# EAGLE schematic dual_motor_driver_v6 (EAGLE 8.2.2)
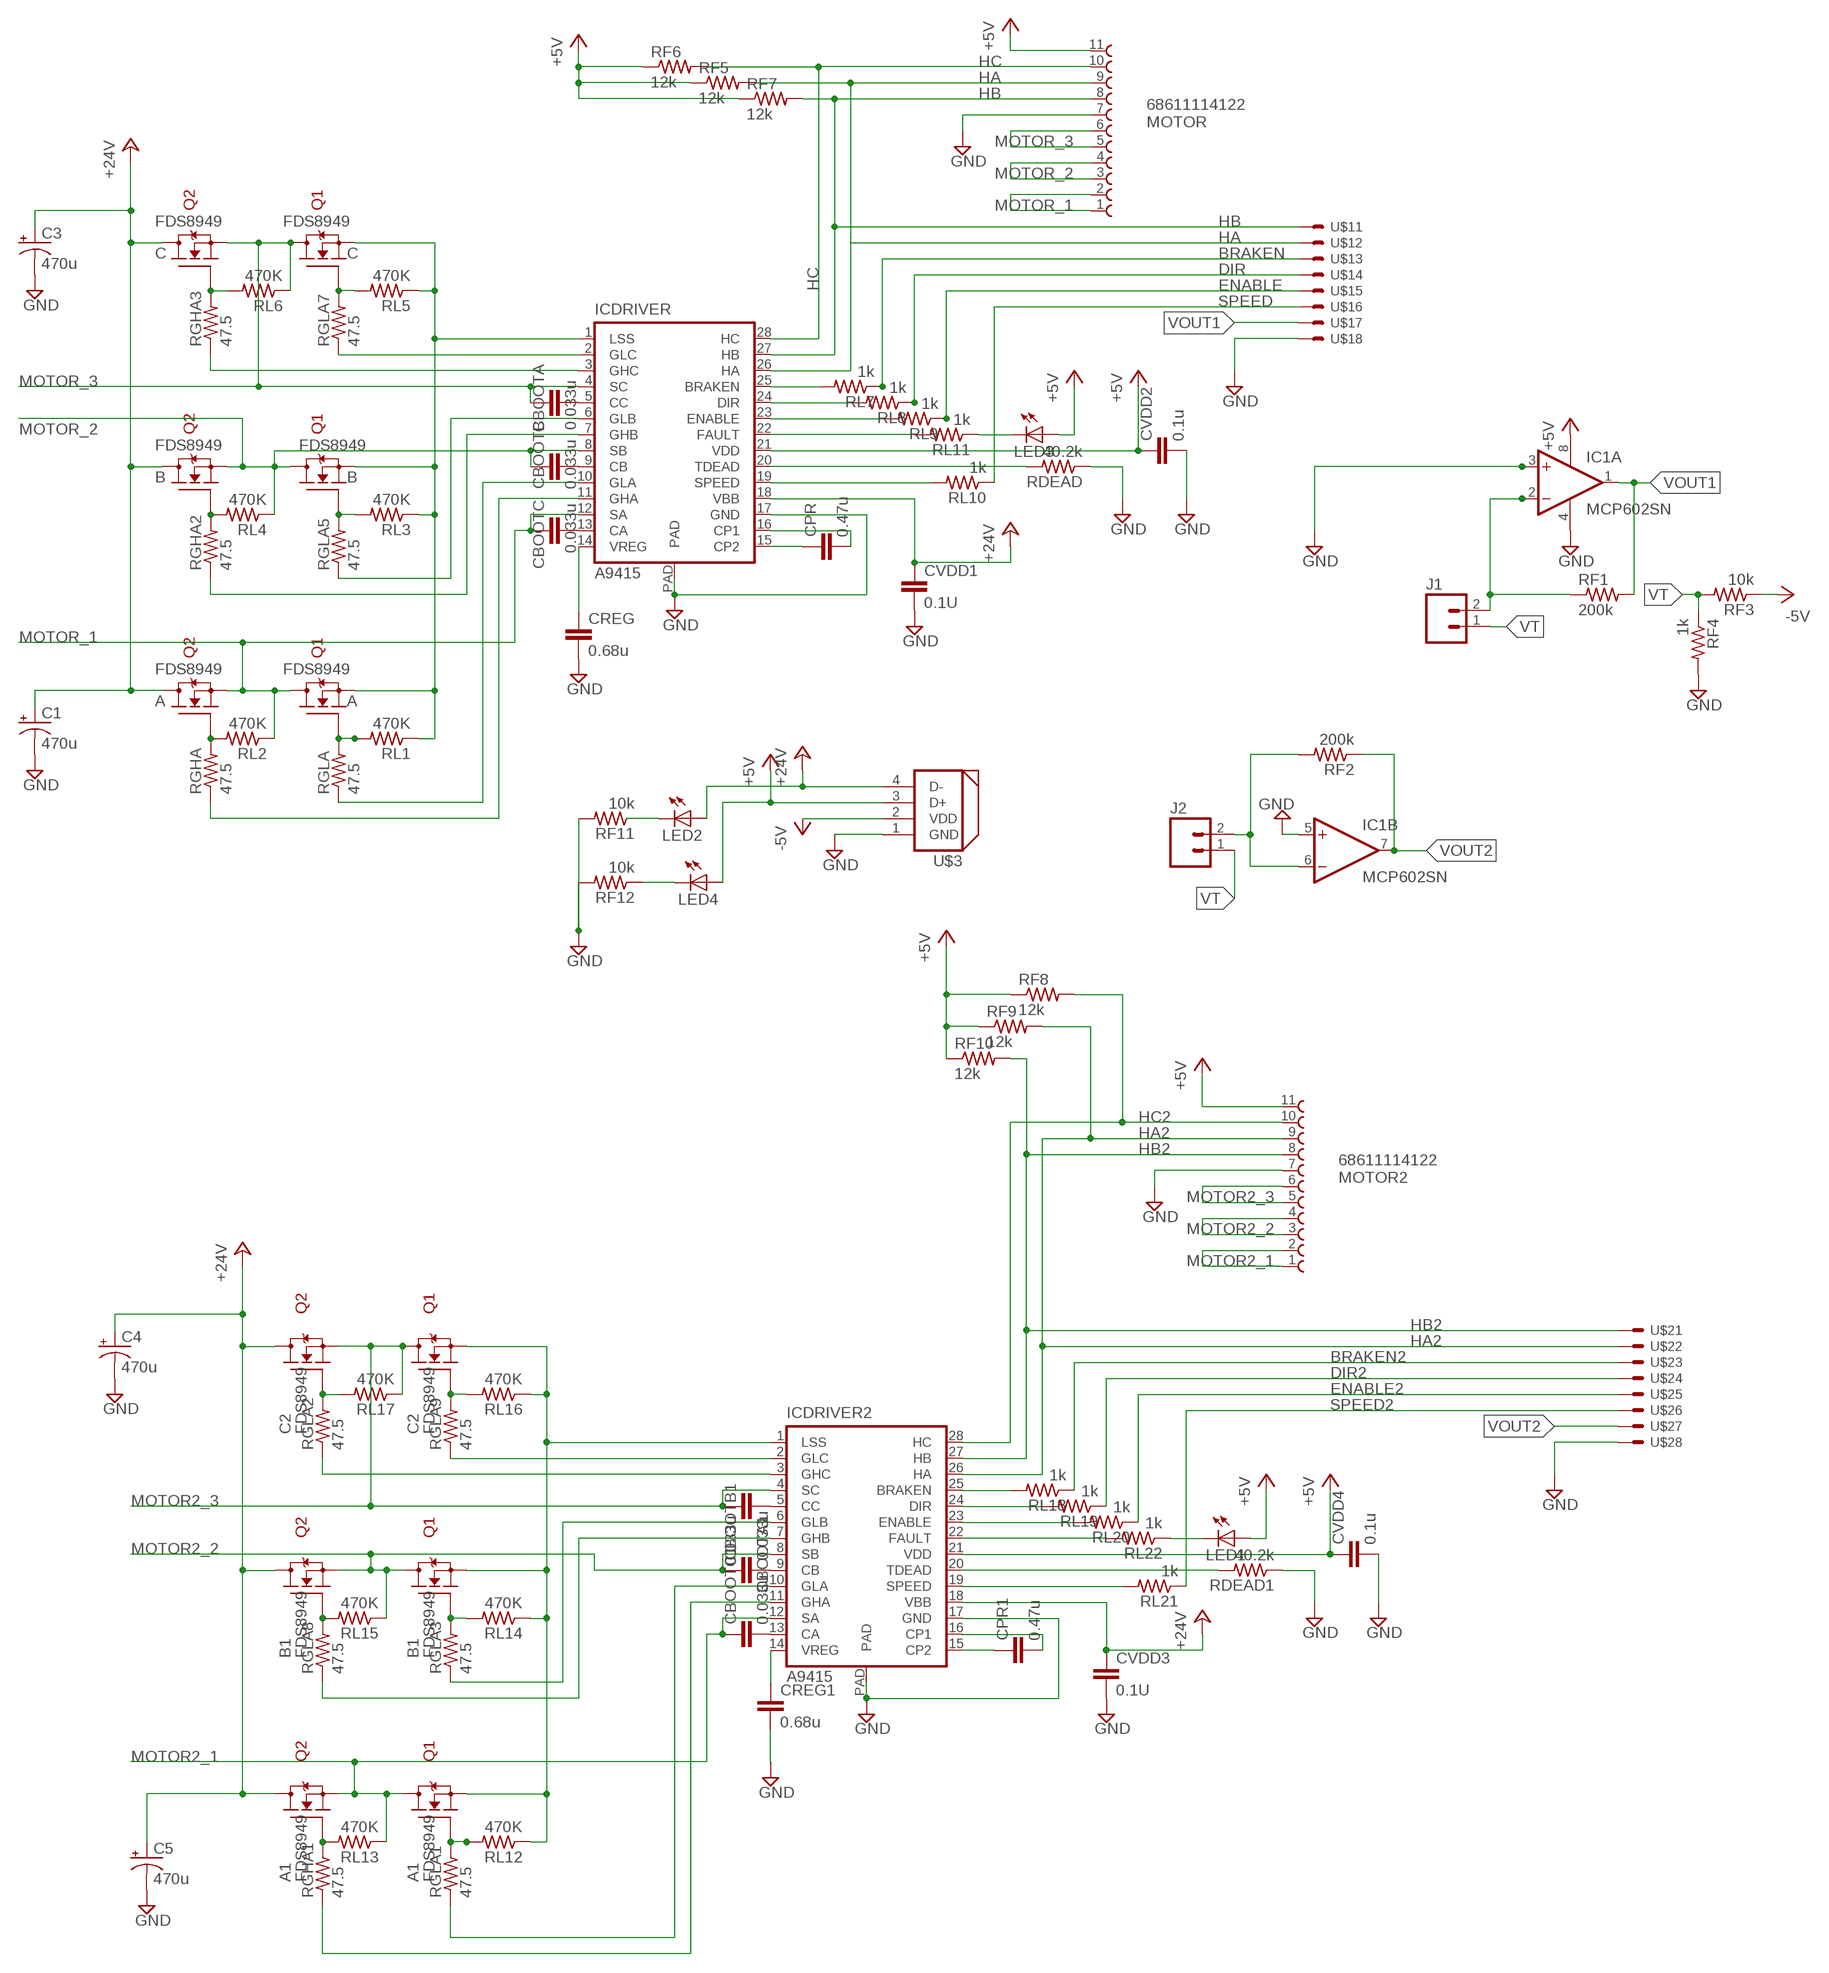
[diagram p0: schematic, sheet 1]

## Parts
A  FDS8949  [SOIC8]
A1  FDS8949  [SOIC8]
B  FDS8949  [SOIC8]
B1  FDS8949  [SOIC8]
C  FDS8949  [SOIC8]
C1  470u  CPOL-US140CLH-1010  [140CLH-1010]
C2  FDS8949  [SOIC8]
C3  470u  CPOL-US140CLH-1010  [140CLH-1010]
C4  470u  CPOL-US140CLH-1010  [140CLH-1010]
C5  470u  CPOL-US140CLH-1010  [140CLH-1010]
CBOOTA  0.033u  C-EUC0805  [C0805]
CBOOTA1  0.033u  C-EUC0805  [C0805]
CBOOTB  0.033u  C-EUC0805  [C0805]
CBOOTB1  0.033u  C-EUC0805  [C0805]
CBOOTC  0.033u  C-EUC0805  [C0805]
CBOOTC1  0.033u  C-EUC0805  [C0805]
CPR  0.47u  C-EUC0805  [C0805]
CPR1  0.47u  C-EUC0805  [C0805]
CREG  0.68u  C-EUC0805  [C0805]
CREG1  0.68u  C-EUC0805  [C0805]
CVDD1  0.1U  C-EUC0805  [C0805]
CVDD2  0.1u  C-EUC0805  [C0805]
CVDD3  0.1U  C-EUC0805  [C0805]
CVDD4  0.1u  C-EUC0805  [C0805]
IC1  MCP602SN  [SO08]
ICDRIVER  A9415  [TSSOP28]
ICDRIVER2  A9415  [TSSOP28]
J1  M02PTH  [1X02]
J2  M02PTH  [1X02]
LED1  LEDCHIPLED_0805  [CHIPLED_0805]
LED2  LEDCHIPLED_0805  [CHIPLED_0805]
LED3  LEDCHIPLED_0805  [CHIPLED_0805]
LED4  LEDCHIPLED_0805  [CHIPLED_0805]
MOTOR  68611114122  [68611114122]
MOTOR2  68611114122  [68611114122]
RDEAD  40.2k  R-US_R0805  [R0805]
RDEAD1  40.2k  R-US_R0805  [R0805]
RF1  200k  R-US_R0805  [R0805]
RF2  200k  R-US_R0805  [R0805]
RF3  10k  R-US_R0805  [R0805]
RF4  1k  R-US_R0805  [R0805]
RF5  12k  R-US_R0805  [R0805]
RF6  12k  R-US_R0805  [R0805]
RF7  12k  R-US_R0805  [R0805]
RF8  12k  R-US_R0805  [R0805]
RF9  12k  R-US_R0805  [R0805]
RF10  12k  R-US_R0805  [R0805]
RF11  10k  R-US_R0805  [R0805]
RF12  10k  R-US_R0805  [R0805]
RGHA  47.5  R-US_R0805  [R0805]
RGHA1  47.5  R-US_R0805  [R0805]
RGHA2  47.5  R-US_R0805  [R0805]
RGHA3  47.5  R-US_R0805  [R0805]
RGLA  47.5  R-US_R0805  [R0805]
RGLA1  47.5  R-US_R0805  [R0805]
RGLA2  47.5  R-US_R0805  [R0805]
RGLA3  47.5  R-US_R0805  [R0805]
RGLA5  47.5  R-US_R0805  [R0805]
RGLA7  47.5  R-US_R0805  [R0805]
RGLA8  47.5  R-US_R0805  [R0805]
RGLA9  47.5  R-US_R0805  [R0805]
RL1  470K  R-US_R0805  [R0805]
RL2  470K  R-US_R0805  [R0805]
RL3  470K  R-US_R0805  [R0805]
RL4  470K  R-US_R0805  [R0805]
RL5  470K  R-US_R0805  [R0805]
RL6  470K  R-US_R0805  [R0805]
RL7  1k  R-US_R0805  [R0805]
RL8  1k  R-US_R0805  [R0805]
RL9  1k  R-US_R0805  [R0805]
RL10  1k  R-US_R0805  [R0805]
RL11  1k  R-US_R0805  [R0805]
RL12  470K  R-US_R0805  [R0805]
RL13  470K  R-US_R0805  [R0805]
RL14  470K  R-US_R0805  [R0805]
RL15  470K  R-US_R0805  [R0805]
RL16  470K  R-US_R0805  [R0805]
RL17  470K  R-US_R0805  [R0805]
RL18  1k  R-US_R0805  [R0805]
RL19  1k  R-US_R0805  [R0805]
RL20  1k  R-US_R0805  [R0805]
RL21  1k  R-US_R0805  [R0805]
RL22  1k  R-US_R0805  [R0805]
U$1  JST8  [JST]
U$2  JST8  [JST]
U$3  DYNAMIXEL_RS485  [DYNAMIXEL_SPOX_04]

## Nets
+5V: CVDD2.1 CVDD4.1 IC1.8(P:V+) ICDRIVER2.21(VDD) ICDRIVER.21(VDD) LED1.A LED3.A LED4.A MOTOR2.11 MOTOR.11 RF5.1 RF6.1 RF7.1 RF8.1 RF9.1 RF10.1 U$3.3(D+)
+24V: A1.5(D2) A1.6(D2) A.5(D2) A.6(D2) B1.5(D2) B1.6(D2) B.5(D2) B.6(D2) C1.+ C2.5(D2) C2.6(D2) C3.+ C4.+ C5.+ C.5(D2) C.6(D2) CVDD1.1 CVDD3.1 ICDRIVER2.18(VBB) ICDRIVER.18(VBB) LED2.A U$3.4(D-)
-5V: RF3.1 U$3.2(VDD)
BRAKEN: RL7.1 U$1.3
BRAKEN2: RL18.1 U$2.3
DIR: RL8.1 U$1.4
DIR2: RL19.1 U$2.4
ENABLE: RL9.1 U$1.5
ENABLE2: RL20.1 U$2.5
GND: A1.1(S1) A.1(S1) B1.1(S1) B.1(S1) C1.- C2.1(S1) C3.- C4.- C5.- C.1(S1) CREG1.2 CREG.2 CVDD1.2 CVDD2.2 CVDD3.2 CVDD4.2 IC1.3(A:+IN) IC1.4(P:V-) IC1.5(B:+IN) ICDRIVER2.1(LSS) ICDRIVER2.17(GND) ICDRIVER2.PAD ICDRIVER.1(LSS) ICDRIVER.17(GND) ICDRIVER.PAD MOTOR2.7 MOTOR.7 RDEAD1.1 RDEAD.1 RF4.2 RF11.2 RF12.2 RL1.1 RL3.1 RL5.1 RL12.1 RL14.1 RL16.1 U$1.8 U$2.8 U$3.1(GND)
HA: ICDRIVER.26(HA) MOTOR.9 RF5.2 U$1.2
HA2: ICDRIVER2.26(HA) MOTOR2.9 RF9.2 U$2.2
HB: ICDRIVER.27(HB) MOTOR.8 RF7.2 U$1.1
HB2: ICDRIVER2.27(HB) MOTOR2.8 RF10.2 U$2.1
HC: ICDRIVER.28(HC) MOTOR.10 RF6.2
HC2: ICDRIVER2.28(HC) MOTOR2.10 RF8.2
MOTOR2_1: A1.3(S2) A1.7(D1) A1.8(D1) CBOOTC1.1 ICDRIVER2.12(SA) MOTOR2.1 MOTOR2.2 RL13.1
MOTOR2_2: B1.3(S2) B1.7(D1) B1.8(D1) CBOOTB1.1 ICDRIVER2.8(SB) MOTOR2.3 MOTOR2.4 RL15.1
MOTOR2_3: C2.3(S2) C2.7(D1) C2.8(D1) CBOOTA1.2 ICDRIVER2.4(SC) MOTOR2.5 MOTOR2.6 RL17.1
MOTOR_1: A.3(S2) A.7(D1) A.8(D1) CBOOTC.1 ICDRIVER.12(SA) MOTOR.1 MOTOR.2 RL2.1
MOTOR_2: B.3(S2) B.7(D1) B.8(D1) CBOOTB.1 ICDRIVER.8(SB) MOTOR.3 MOTOR.4 RL4.1
MOTOR_3: C.3(S2) C.7(D1) C.8(D1) CBOOTA.2 ICDRIVER.4(SC) MOTOR.5 MOTOR.6 RL6.1
N$1: A1.2(G1) RGLA1.2 RL12.2
N$2: A1.4(G2) RGHA1.2 RL13.2
N$3: B1.2(G1) RGLA3.2 RL14.2
N$4: B1.4(G2) RGLA8.2 RL15.2
N$5: C2.2(G1) RGLA9.2 RL16.2
N$6: C2.4(G2) RGLA2.2 RL17.2
N$7: B.2(G1) RGLA5.2 RL3.2
N$8: B.4(G2) RGHA2.2 RL4.2
N$9: ICDRIVER2.11(GHA) RGHA1.1
N$10: ICDRIVER2.10(GLA) RGLA1.1
N$11: ICDRIVER2.6(GLB) RGLA3.1
N$12: ICDRIVER2.7(GHB) RGLA8.1
N$13: CBOOTA1.1 ICDRIVER2.5(CC)
N$14: CBOOTB1.2 ICDRIVER2.9(CB)
N$15: C.2(G1) RGLA7.2 RL5.2
N$16: CPR.1 ICDRIVER.15(CP2)
N$17: ICDRIVER.11(GHA) RGHA.1
N$18: C.4(G2) RGHA3.2 RL6.2
N$19: CREG1.1 ICDRIVER2.14(VREG)
N$20: ICDRIVER.10(GLA) RGLA.1
N$21: CREG.1 ICDRIVER.14(VREG)
N$22: CBOOTC.2 ICDRIVER.13(CA)
N$23: CBOOTC1.2 ICDRIVER2.13(CA)
N$24: ICDRIVER.2(GLC) RGLA7.1
N$25: ICDRIVER.6(GLB) RGLA5.1
N$26: ICDRIVER.7(GHB) RGHA2.1
N$27: ICDRIVER.3(GHC) RGHA3.1
N$28: CBOOTB.2 ICDRIVER.9(CB)
N$29: CPR.2 ICDRIVER.16(CP1)
N$30: ICDRIVER2.2(GLC) RGLA9.1
N$31: CBOOTA.1 ICDRIVER.5(CC)
N$32: A.2(G1) RGLA.2 RL1.2
N$33: A.4(G2) RGHA.2 RL2.2
N$34: ICDRIVER2.3(GHC) RGLA2.1
N$35: CPR1.1 ICDRIVER2.15(CP2)
N$36: CPR1.2 ICDRIVER2.16(CP1)
N$37: ICDRIVER2.19(SPEED) RL21.2
N$38: ICDRIVER2.23(ENABLE) RL20.2
N$39: ICDRIVER2.24(DIR) RL19.2
N$40: ICDRIVER.19(SPEED) RL10.2
N$41: ICDRIVER.23(ENABLE) RL9.2
N$42: ICDRIVER.24(DIR) RL8.2
N$43: ICDRIVER2.25(BRAKEN) RL18.2
N$44: ICDRIVER.25(BRAKEN) RL7.2
N$45: ICDRIVER.20(TDEAD) RDEAD.2
N$46: ICDRIVER.22(FAULT) RL11.2
N$47: LED3.C RL11.1
N$48: LED2.C RF11.1
N$49: ICDRIVER2.20(TDEAD) RDEAD1.2
N$50: ICDRIVER2.22(FAULT) RL22.2
N$51: LED1.C RL22.1
N$52: IC1.2(A:-IN) J1.2 RF1.1
N$59: LED4.C RF12.1
N$82: IC1.6(B:-IN) J2.2 RF2.2
SPEED: RL10.1 U$1.6
SPEED2: RL21.1 U$2.6
VOUT1: IC1.1(A:OUT) RF1.2 U$1.7
VOUT2: IC1.7(B:OUT) RF2.1 U$2.7
VT: J1.1 J2.1 RF3.2 RF4.1

## Library data of the parts
A A1 B B1 C C2 = dedo:FDS8949: Dual N-Channel PowerTrench® MOSFET https://www.fairchildsemi.com/datasheets/FD/FDS8949.pdf
C1 C3-C5 = resistor:CPOL-US: POLARIZED CAPACITOR, American symbol
CBOOTA CBOOTA1 CBOOTB CBOOTB1 CBOOTC CBOOTC1 CPR CPR1 CREG CREG1 CVDD1-CVDD4 = resistor:C-EU: CAPACITOR, European symbol
IC1 = dedo:MCP602: Single Op Amp 2.7V to 6.0V Single Supply CMOS Source: http://ww1.microchip.com/downloads/en/DeviceDoc/21314g.pdf
ICDRIVER ICDRIVER2 = dedo:A9415: A4915 3-Phase MOSFET Driver The A4915 is designed for pulse width modulated (PWM) current control of 3-phase brushless DC motors. The A4915 is capable of high current gate drive for 6 all N-channel power MOSFETs. An internal charge pump ensures gate drive down to 7 V supply and provides limited gate drive down to 5 V. A bootstrap capacitor is used to generate a supply voltage greater than the source voltage of the high side MOSFET, required for N-channel MOSFETs. Details see: http://www.allegromicro.com/~/media/Files/Datasheets/A4915-Datasheet.ashx?la=en
J1 J2 = uchile_robotics_eagle_lib:M02: Standard 2-pin 0.1" header. Use with - straight break away headers ( PRT-00116) - right angle break away headers (PRT-00553) - swiss pins (PRT-00743) - machine pins (PRT-00117) - female headers (PRT-00115) Molex polarized connector foot print use with: PRT-08233 with associated crimp pins and housings. 2.54_SCREWTERM for use with PRT-10571. 3.5mm Screw Terminal footprints for PRT-08084 5mm Screw Terminal footprints for use with PRT-08432
LED1-LED4 = adafruit:LED: LED OSRAM: - CHIPLED LG R971, LG N971, LY N971, LG Q971, LY Q971, LO R971, LY R971 LH N974, LH R974 LS Q976, LO Q976, LY Q976 LO Q996 - Hyper CHIPLED LW Q18S LB Q993, LB Q99A, LB R99A - SideLED LS A670, LO A670, LY A670, LG A670, LP A670 LB A673, LV A673, LT A673, LW A673 LH A674 LY A675 LS A676, LA A676, LO A676, LY A676, LW A676 LS A679, LY A679, LG A679 - Hyper Micro SIDELED® LS Y876, LA Y876, LO Y876, LY Y876 LT Y87S - SmartLED LW L88C, LW L88S LB L89C, LB L89S, LG L890 LS L89K, LO L89K, LY L89K LS L896, LA L896, LO L896, LY L896 - TOPLED LS T670, LO T670, LY T670, LG T670, LP T670 LSG T670, LSP T670, LSY T670, LOP T670, LYG T670 LG T671, LOG T671, LSG T671 LB T673, LV T673, LT T673, LW T673 LH T674 LS T676, LA T676, LO T676, LY T676, LB T676, LH T676, LSB T676, LW T676 LB T67C, LV T67C, LT T67C, LS T67K, LO T67K, LY T67K, LW E67C LS E67B, LA E67B, LO E67B, LY E67B, LB E67C, LV E67C, LT E67C LW T67C LS T679, LY T679, LG T679 LS T770, LO T770, LY T770, LG T770, LP T770 LB T773, LV T773, LT T773, LW T773 LH T774 LS E675, LA E675, LY E675, LS T675 LS T776, LA T776, LO T776, LY T776, LB T776 LHGB T686 LT T68C, LB T68C - Hyper Mini TOPLED® LB M676 - Mini TOPLED Santana® LG M470 LS M47K, LO M47K, LY M47K Source: http://www.osram.convergy.de/
MOTOR MOTOR2 = FPC_Connectors_Flat_Flexible_Cable_rev15c:68611114122: WR-FPC 1.00mm SMT ZIF Horizontal Top Contact, 11 Pins=>Code : Con_FPC_ZIF_1.00_68611114122 <http://katalog.we-online.de/media/images/eican/Con_FPC_ZIF_1.00_6861xx14122_pf2.jpg> Details see: http://katalog.we-online.de/en/em/686_1xx_141_22 Created 2014-07-09, Karrer Zheng 2014 (C) Würth Elektronik
RDEAD RDEAD1 RF1-RF12 RGHA RGHA1-RGHA3 RGLA RGLA1-RGLA3 RGLA5 RGLA7-RGLA9 RL1-RL22 = resistor:R-US_: RESISTOR, American symbol
U$1 U$2 = dedo:JST8
U$3 = uchile_robotics_eagle_lib:DYNAMIXEL_RS485: Dynamixel RS-485 Connector Molex LLC SPOX 4 Male connector Digikey code: WM18888-ND

## Net classes
0 default: clearance 0.205 mm